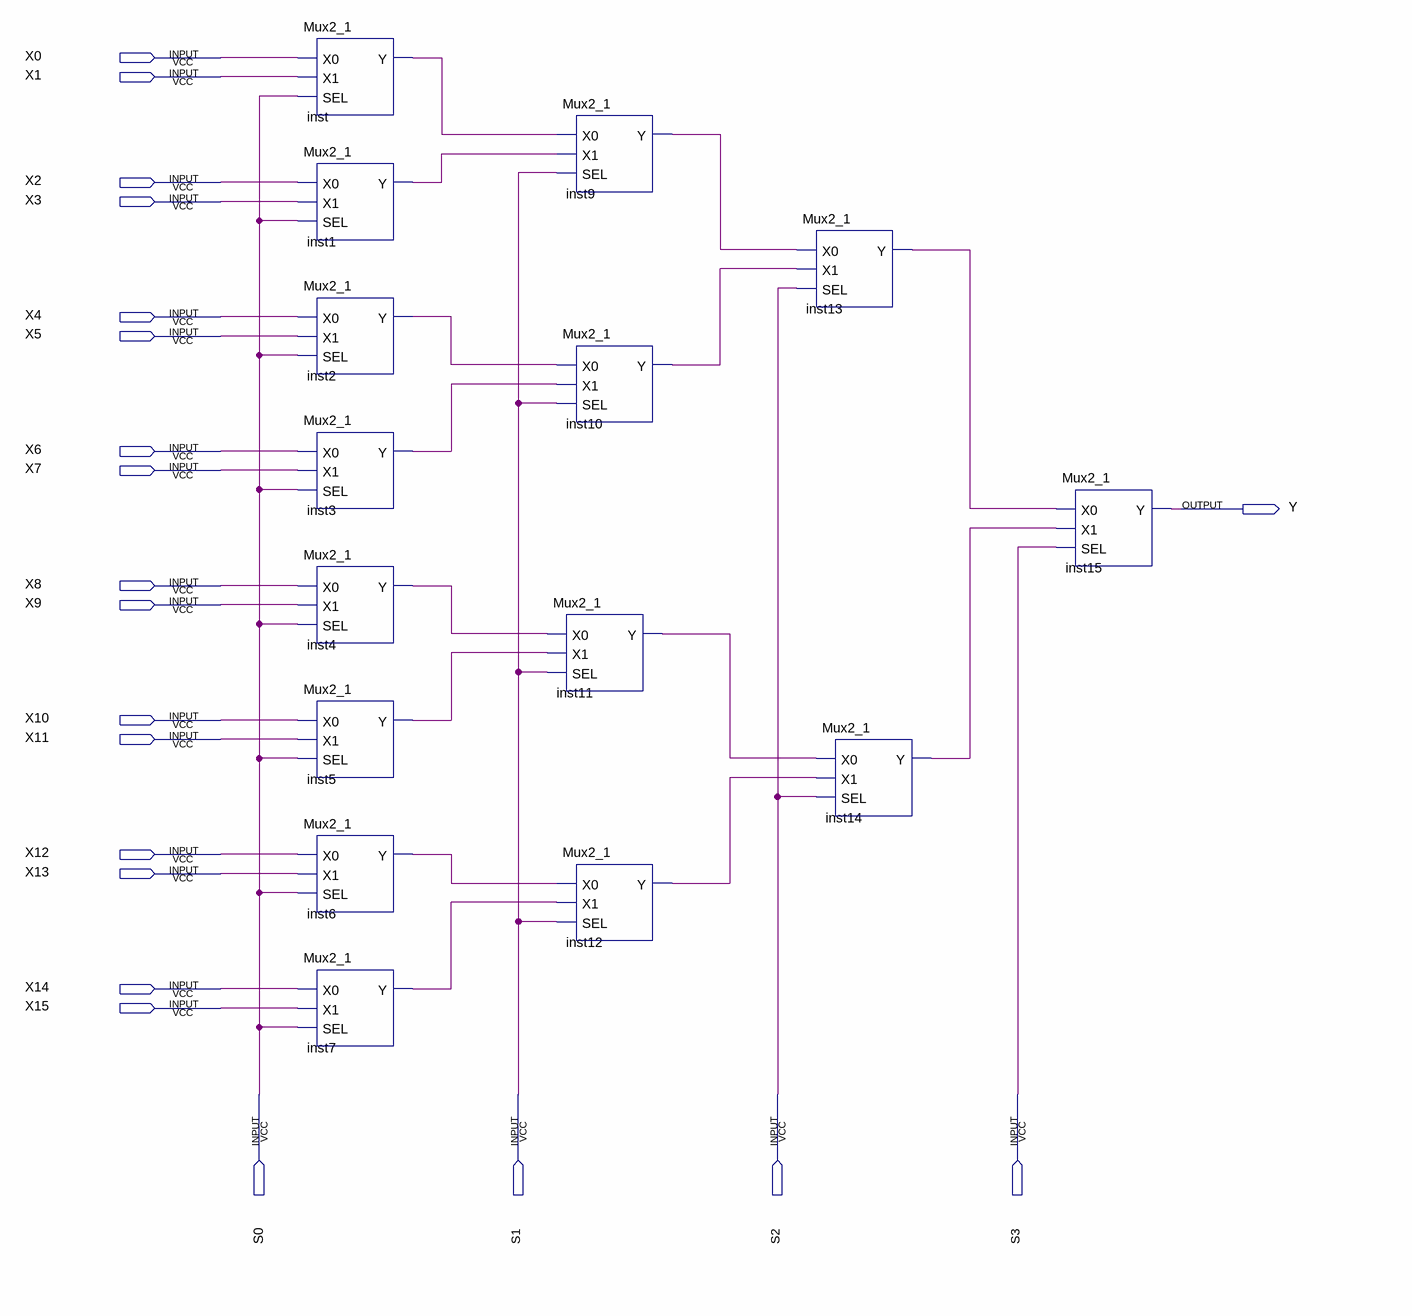
[diagram p0: schematic sheet]
// Quartus schematic Mux16_1.bdf as structural Verilog: 15 symbols, 21 pins
module Mux16_1 (
  input  X0,
  input  X1,
  input  X2,
  input  X3,
  input  X4,
  input  X5,
  input  X6,
  input  X7,
  input  X8,
  input  X9,
  input  X10,
  input  X11,
  input  X12,
  input  X13,
  input  X14,
  input  X15,
  input  S0,
  input  S1,
  input  S2,
  input  S3,
  output Y
);

  wire inst1_y, inst2_y, inst3_y, inst4_y, inst5_y, inst6_y, inst7_y, inst9_y, inst10_y, inst11_y, inst12_y,
       inst13_y, inst14_y, inst_y;

  Mux2_1 inst (.X0(X0), .X1(X1), .SEL(S0), .Y(inst_y));
  Mux2_1 inst1 (.X0(X2), .X1(X3), .SEL(S0), .Y(inst1_y));
  Mux2_1 inst2 (.X0(X4), .X1(X5), .SEL(S0), .Y(inst2_y));
  Mux2_1 inst3 (.X0(X6), .X1(X7), .SEL(S0), .Y(inst3_y));
  Mux2_1 inst4 (.X0(X8), .X1(X9), .SEL(S0), .Y(inst4_y));
  Mux2_1 inst5 (.X0(X10), .X1(X11), .SEL(S0), .Y(inst5_y));
  Mux2_1 inst6 (.X0(X12), .X1(X13), .SEL(S0), .Y(inst6_y));
  Mux2_1 inst7 (.X0(X14), .X1(X15), .SEL(S0), .Y(inst7_y));
  Mux2_1 inst9 (.X0(inst_y), .X1(inst1_y), .SEL(S1), .Y(inst9_y));
  Mux2_1 inst10 (.X0(inst2_y), .X1(inst3_y), .SEL(S1), .Y(inst10_y));
  Mux2_1 inst11 (.X0(inst4_y), .X1(inst5_y), .SEL(S1), .Y(inst11_y));
  Mux2_1 inst12 (.X0(inst6_y), .X1(inst7_y), .SEL(S1), .Y(inst12_y));
  Mux2_1 inst13 (.X0(inst9_y), .X1(inst10_y), .SEL(S2), .Y(inst13_y));
  Mux2_1 inst14 (.X0(inst11_y), .X1(inst12_y), .SEL(S2), .Y(inst14_y));
  Mux2_1 inst15 (.X0(inst13_y), .X1(inst14_y), .SEL(S3), .Y(Y));
endmodule
